# EAGLE design monitoring (EAGLE 6.5.0)
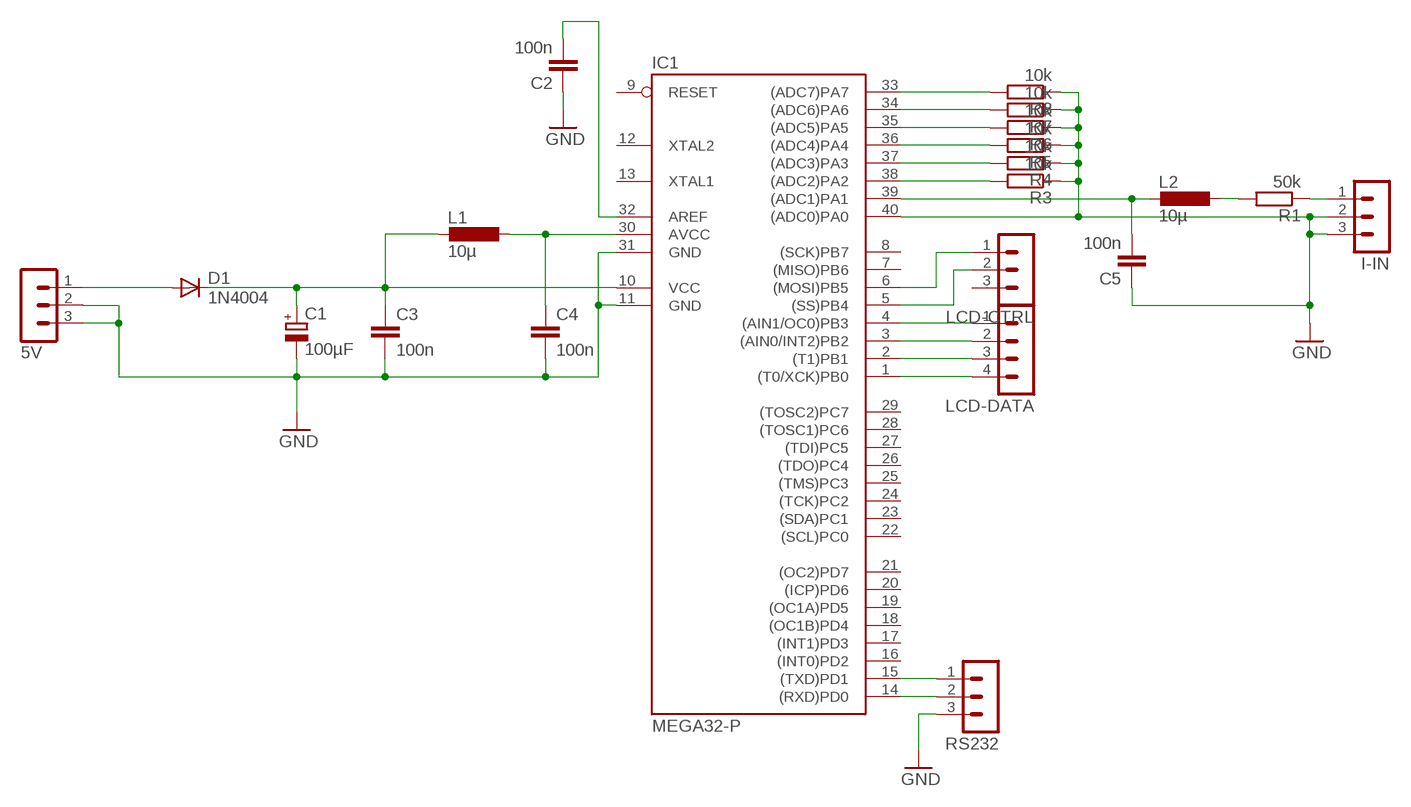
[diagram p0: schematic, sheet 1]

## Parts
5V  MA03-1  [MA03-1]
C1  100µF  CPOL-EUE5-10.5  [E5-10,5]
C2  100n  C-EU050-035X075  [C050-035X075]
C3  100n  C-EU050-035X075  [C050-035X075]
C4  100n  C-EU050-035X075  [C050-035X075]
C5  100n  C-EU050-035X075  [C050-035X075]
D1  1N4004  [DO41-10]
I-IN  MA03-1  [MA03-1]
IC1  MEGA32-P  [DIL40]
L1  10µ  L-EU0204V  [0204V]
L2  10µ  L-EU0207/10  [0207/10]
LCD-CTRL  MA03-1  [MA03-1]
LCD-DATA  MA04-1  [MA04-1]
R1  50k  R-EU_0204/2V  [0204V]
R3  10k  R-EU_0204/2V  [0204V]
R4  10k  R-EU_0204/2V  [0204V]
R5  10k  R-EU_0204/2V  [0204V]
R6  10k  R-EU_0204/2V  [0204V]
R7  10k  R-EU_0204/2V  [0204V]
R8  10k  R-EU_0204/2V  [0204V]
RS232  MA03-1  [MA03-1]

## Nets
GND: 5V.2 5V.3 C1.- C2.1 C3.2 C4.2 C5.1 I-IN.2 I-IN.3 IC1.11(GND) IC1.31(GND) IC1.40((ADC0)PA0) R3.1 R4.1 R5.1 R6.1 R7.1 R8.1 RS232.3
N$1: IC1.4((AIN1/OC0)PB3) LCD-DATA.1
N$2: C1.+ C3.1 D1.C IC1.10(VCC) L1.2
N$3: IC1.38((ADC2)PA2) R3.2
N$4: IC1.3((AIN0/INT2)PB2) LCD-DATA.2
N$5: C5.2 IC1.39((ADC1)PA1) L2.2
N$6: IC1.37((ADC3)PA3) R4.2
N$8: IC1.2((T1)PB1) LCD-DATA.3
N$9: IC1.1((T0/XCK)PB0) LCD-DATA.4
N$10: IC1.5((SS)PB4) LCD-CTRL.2
N$11: IC1.6((MOSI)PB5) LCD-CTRL.1
N$12: 5V.1 D1.A
N$13: IC1.36((ADC4)PA4) R5.2
N$14: C2.2 IC1.32(AREF)
N$15: IC1.14((RXD)PD0) RS232.2
N$16: IC1.15((TXD)PD1) RS232.1
N$17: IC1.35((ADC5)PA5) R6.2
N$18: IC1.34((ADC6)PA6) R7.2
N$19: IC1.33((ADC7)PA7) R8.2
N$20: C4.1 IC1.30(AVCC) L1.1
N$21: L2.1 R1.2
N$22: I-IN.1 R1.1
Unconnected: IC1.7((MISO)PB6) IC1.8((SCK)PB7) IC1.9(RESET) IC1.12(XTAL2) IC1.13(XTAL1) IC1.16((INT0)PD2) IC1.17((INT1)PD3) IC1.18((OC1B)PD4) IC1.19((OC1A)PD5) IC1.20((ICP)PD6) IC1.21((OC2)PD7) IC1.22((SCL)PC0) IC1.23((SDA)PC1) IC1.24((TCK)PC2) IC1.25((TMS)PC3) IC1.26((TDO)PC4) IC1.27((TDI)PC5) IC1.28((TOSC1)PC6) IC1.29((TOSC2)PC7) LCD-CTRL.3

## Library data of the parts
5V I-IN LCD-CTRL RS232 = con-lstb:MA03-1: PIN HEADER; OC_FARNELL: unknown; OC_NEWARK: unknown
C1 = rcl:CPOL-EU: POLARIZED CAPACITOR, European symbol
C2-C5 = rcl:C-EU: CAPACITOR, European symbol
D1 = diode:1N4004: DIODE general purpose rectifier, 1 A
IC1 = atmel:MEGA32-P: MICROCONTROLLER 32 Kbytes FLASH 2 Kbytes SRAM 1 Kbytes EEPROM USART 8-channel 10 bit ADC Source: www.atmel.com .. doc2503.pdf; MPN: ATMEGA32-16PU; OC_FARNELL: 1661729; OC_NEWARK: 51P1794
L1 L2 = rcl:L-EU: INDUCTOR, European symbol
LCD-DATA = con-lstb:MA04-1: PIN HEADER; OC_FARNELL: unknown; OC_NEWARK: unknown
R1 R3-R8 = rcl:R-EU_: RESISTOR, European symbol

## Board
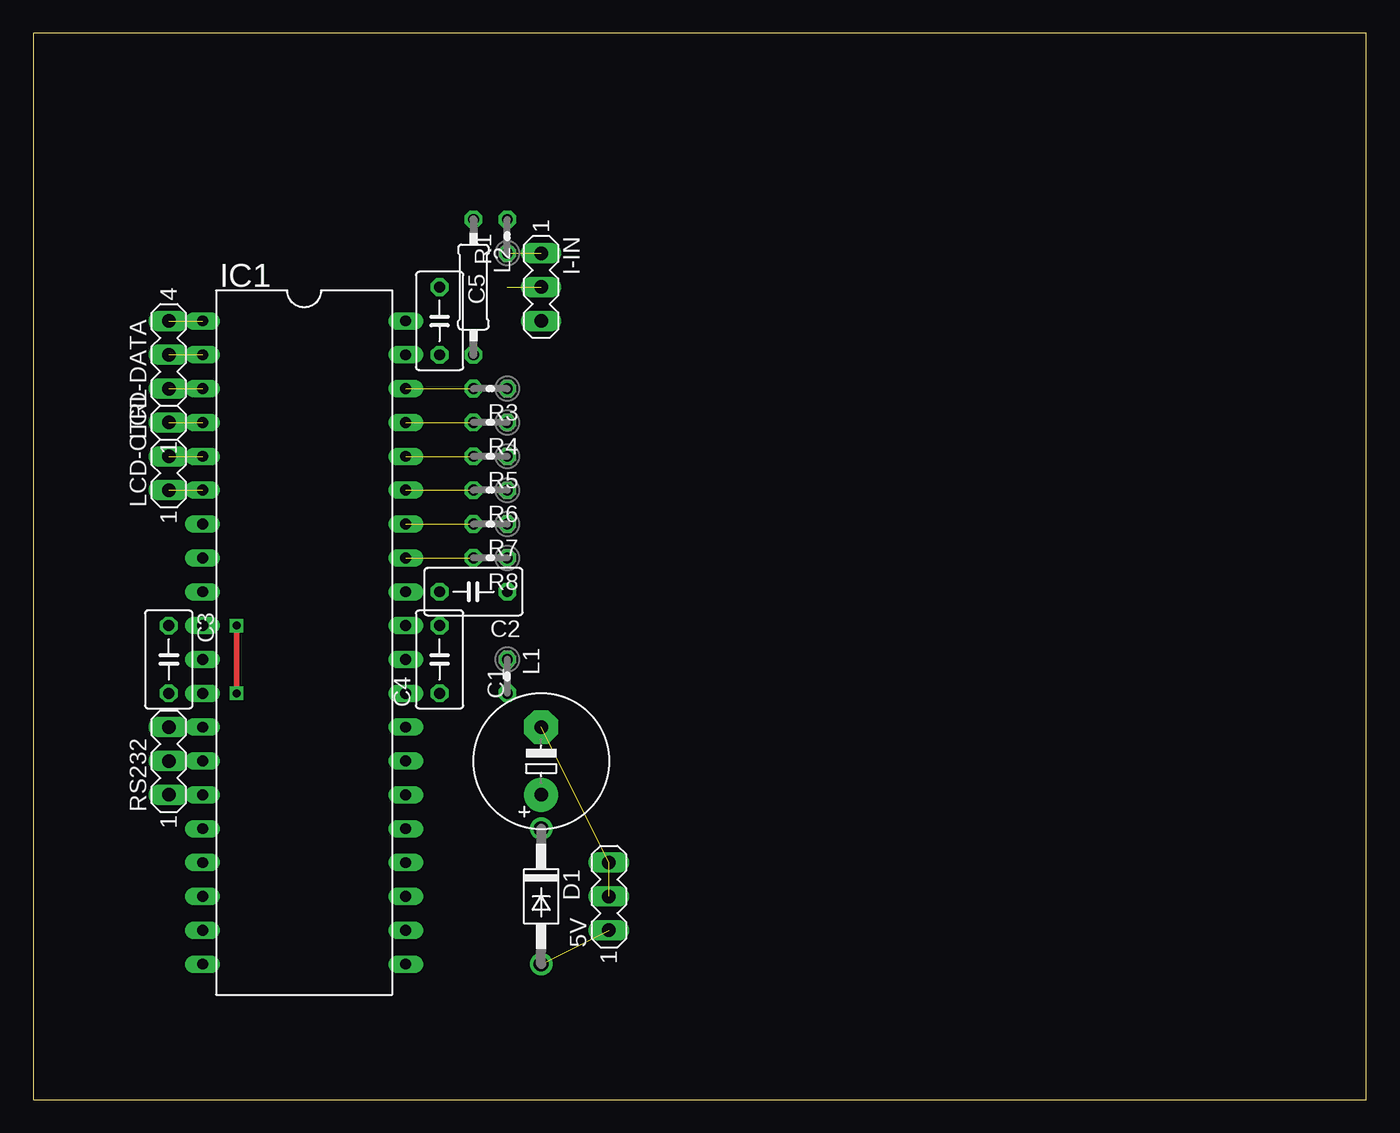
[diagram p1: board, top side]
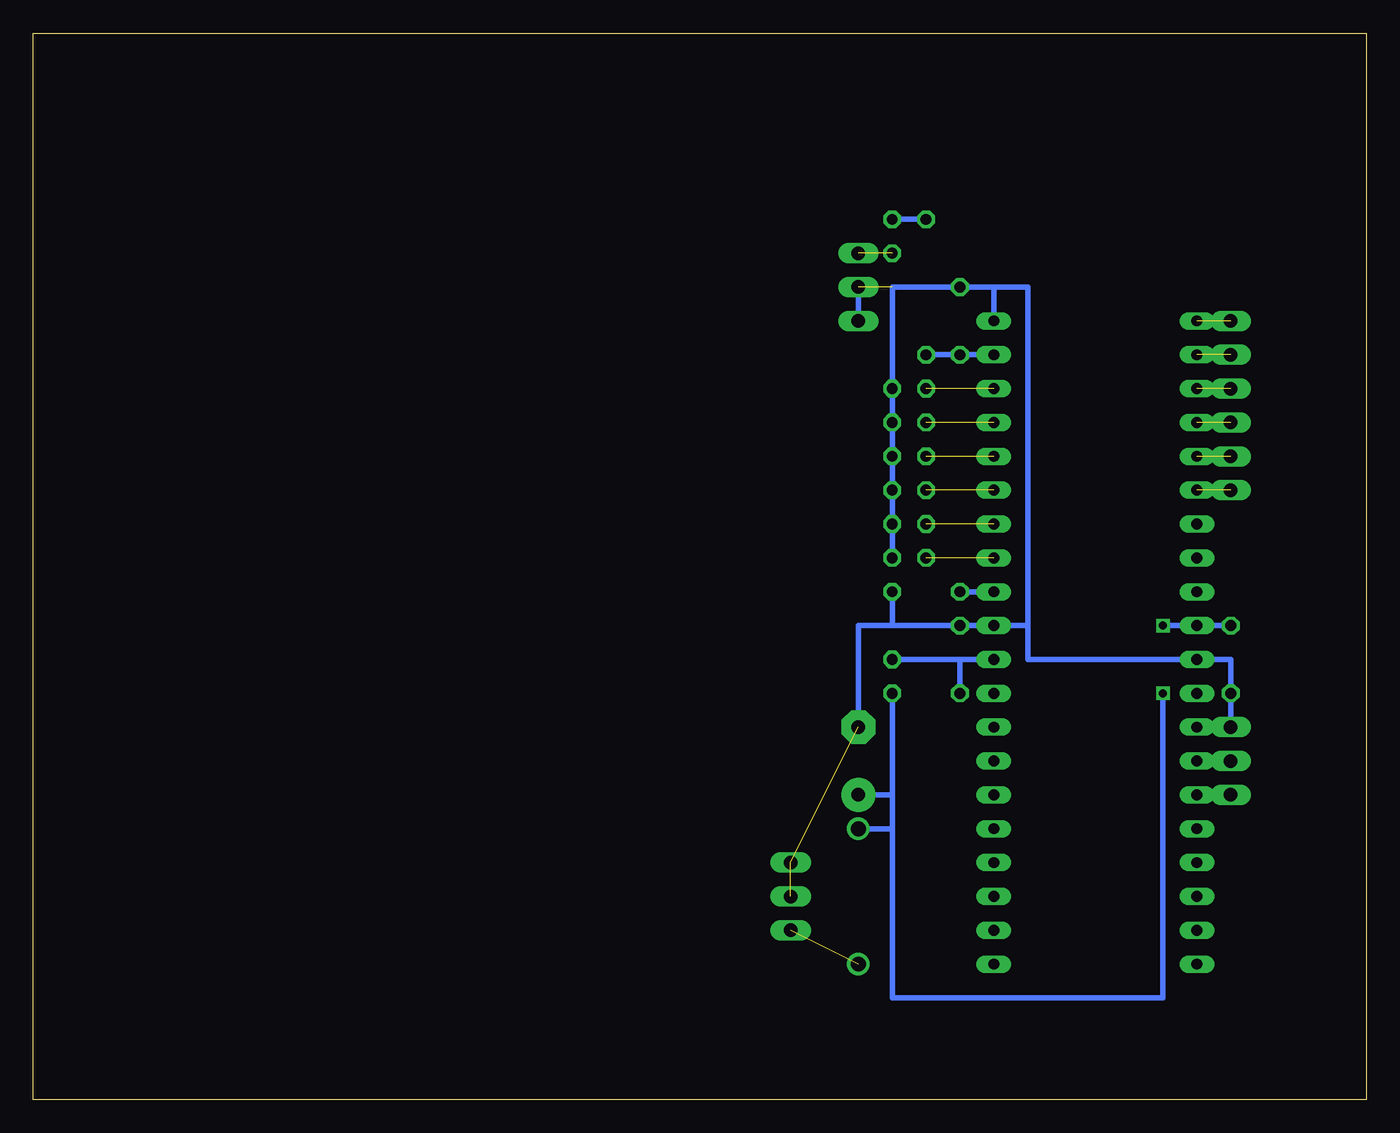
[diagram p2: board, bottom side, seen from below]

Size 100 x 80 mm. Coordinates in mm from the lower left corner, seen from the top.
Outline: 0,0 100,0 100,80 0,80 0,0
Copper layers (1*16): Top 0.035mm / dielectric 1.5mm / Bottom 0.035mm
Design rules "default": minimum track width 10mil, minimum drill 24mil, track to track 8mil, track to pad 8mil, pad to pad 8mil, via to via 8mil, smd to smd 8mil, copper to edge 40mil, drill to drill 8mil, minimum pad ring 10mil, minimum via ring 8mil, stop-mask expansion 4mil, vias tented up to drill 0mil, thermal gap 10mil

### Footprints (pad centres in the part's own frame; a part is rotated, then mirrored left to right if it is on the bottom)
MA03-1 = drill 1.016 long: 1 -2.54,0; 2 0,0; 3 2.54,0
E5-10,5 = drill 1.016 pad 2.54: + -2.54,0 | drill 1.016 pad 2.54 octagon: - 2.54,0
C050-035X075 = drill 0.813 octagon: 1 -2.54,0; 2 2.54,0
DO41-10 = drill 1.118: A 5.08,0; C -5.08,0
DIL40 = drill 0.813 long: 1 -24.13,-7.62; 2 -21.59,-7.62; 3 -19.05,-7.62; 4 -16.51,-7.62; 5 -13.97,-7.62; 6 -11.43,-7.62; 7 -8.89,-7.62; 8 -6.35,-7.62; 9 -3.81,-7.62; 10 -1.27,-7.62; 11 1.27,-7.62; 12 3.81,-7.62; 13 6.35,-7.62; 14 8.89,-7.62; 15 11.43,-7.62; 16 13.97,-7.62; 17 16.51,-7.62; 18 19.05,-7.62; 19 21.59,-7.62; 20 24.13,-7.62; 21 24.13,7.62; 22 21.59,7.62; 23 19.05,7.62; 24 16.51,7.62; 25 13.97,7.62; 26 11.43,7.62; 27 8.89,7.62; 28 6.35,7.62; 29 3.81,7.62; 30 1.27,7.62; 31 -1.27,7.62; 32 -3.81,7.62; 33 -6.35,7.62; 34 -8.89,7.62; 35 -11.43,7.62; 36 -13.97,7.62; 37 -16.51,7.62; 38 -19.05,7.62; 39 -21.59,7.62; 40 -24.13,7.62
0204V = drill 0.813 octagon: 1 -1.27,0; 2 1.27,0
0207/10 = drill 0.813 octagon: 1 -5.08,0; 2 5.08,0
MA04-1 = drill 1.016 long: 1 -3.81,0; 2 -1.27,0; 3 1.27,0; 4 3.81,0

### Placement (x,y rotation side)
5V  43.18,15.24 90 top
C1  38.1,25.4 90 top
C2  33.02,38.1 180 top
C3  10.16,33.02 270 top
C4  30.48,33.02 90 top
C5  30.48,58.42 270 top
D1  38.1,15.24 270 top
I-IN  38.1,60.96 270 top
IC1  20.32,34.29 270 top
L1  35.56,31.75 270 top
L2  33.02,60.96 270 top
LCD-CTRL  10.16,48.26 90 top
LCD-DATA  10.16,54.61 90 top
R1  35.56,64.77 90 top
R3  34.29,53.34 180 top
R4  34.29,50.8 180 top
R5  34.29,48.26 180 top
R6  34.29,45.72 180 top
R7  34.29,43.18 180 top
R8  34.29,40.64 180 top
RS232  10.16,25.4 90 top

### Tracks (layer width: path | path; a pad name or v marks a point on that pad's centre or on a via)
GND  (3 unrouted)
  Bottom 0.406: RS232.3 C3.2 10.16,33.02 IC1.11 25.4,33.02 25.4,35.56 | 25.4,35.56 25.4,60.96 27.94,60.96 | 25.4,35.56 IC1.31 C4.2 35.56,35.56 | 35.56,35.56 C2.1 | IC1.40 27.94,60.96 | R8.1 R7.1 R6.1 R5.1 R4.1 R3.1 35.56,60.96 C5.1 27.94,60.96 | I-IN.2 I-IN.3 | C1.- 38.1,35.56 35.56,35.56
N$1  (1 unrouted)
N$2  (via drill 0.6)
  Top 0.406: v15.24,35.56 v15.24,30.48
  Bottom 0.406: C3.1 IC1.10 v15.24,35.56 | v15.24,30.48 15.24,7.62 35.56,7.62 35.56,20.32 | 35.56,20.32 35.56,22.86 | 35.56,22.86 L1.2 | D1.C 35.56,20.32 | C1.+ 35.56,22.86
N$3  (1 unrouted)
N$4  (1 unrouted)
N$5
  Bottom 0.406: C5.2 IC1.39 L2.2
N$6  (1 unrouted)
N$8  (1 unrouted)
N$9  (1 unrouted)
N$10  (1 unrouted)
N$11  (1 unrouted)
N$12  (1 unrouted)
N$13  (1 unrouted)
N$14
  Bottom 0.406: C2.2 IC1.32
N$15
  Bottom 0.406: IC1.14 RS232.2
N$16
  Bottom 0.406: IC1.15 RS232.1
N$17  (1 unrouted)
N$18  (1 unrouted)
N$19  (1 unrouted)
N$20
  Bottom 0.406: IC1.30 30.48,33.02 | 30.48,33.02 C4.1 | L1.1 30.48,33.02
N$21
  Bottom 0.406: L2.1 R1.2
N$22  (1 unrouted)